# Altium schematic sheet Morpheus_IMU.SchDoc: IMU Motion Detecter
size Letter; CompanyName: Hello Inc.; Organization: Hello Inc.; Revision: DVT; SheetNumber: 3; SheetTotal: 4
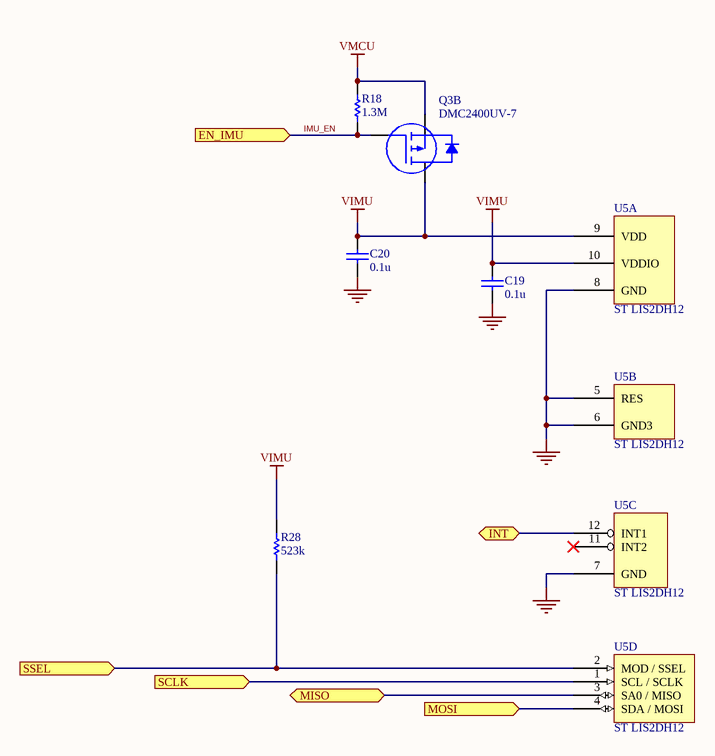
[diagram p0: Morpheus_IMU.SchDoc]

## Parts
C19  0.1u  [CAP0402_SENSE_DVT]
C20  0.1u  [CAP0402_SENSE_DVT]
Q3  DMC2400UV-7  [SOT-563]  (part B of 2)
R18  1.3M  [RES0402_SENSE_DVT]
R28  523k  [RES0402_SENSE_DVT]
U5  ST LIS2DH12  [DFN50P200X200X80-12N]  (parts A,B,C,D of 4)

## Ports
EN_IMU (in), INT (bidir), MISO, MOSI (in), SCLK (in), SSEL (in)

## Nets
GND: C19.1 C20.1 U5.5(RES) U5.6(GND3) U5.7(GND) U5.8(GND)
VIMU: C19.2 C20.2 Q3.3(D2) R28.2 U5.9(VDD) U5.10(VDDIO)
VMCU: Q3.4(S2) R18.2
IMU_EN: Q3.5(G2) R18.1 ; port EN_IMU
INT: U5.12(INT1) ; port INT
MISO: U5.3(SA0_/_MISO) ; port MISO
MOSI: U5.4(SDA_/_MOSI) ; port MOSI
SCLK: U5.1(SCL_/_SCLK) ; port SCLK
SSEL: R28.1 U5.2(MOD_/_SSEL) ; port SSEL

Not connected (* = marked no-connect by the designer): U5 11(INT2)*

## Notes on the sheet
- TITLE
- DATE
- DRAWN BY
- REV
- SHEET
- OF

## Library data of the parts
C19 C20 = C_0.1u_10_50_X7R_0402: Chip capacitor; Vendor: Taiyo Yuden; PN: UMK105B7104KV-FR; Tolerance: 10%; Voltage: 50V; Temp: X7R; Value: 0.1u; Size: 0402
Q3 = DMC2400UV-7: Dual PN-Channel MOSFET 1.2v drive 20V 0.88A; Vendor: Diodes Inc; PN: DMC2400UV-7
R18 = R_1.3M_5_0.1_0402: Chip Resistor; Vendor: Panasonic; Tolerance: 5 %; Power: 0.1 W; PN: ERJ-2GEJ135X; Model: *; Value: 1.3M; Size: 0402
R28 = R_523k_1_0.1_0402: Chip Resistor; Vendor: Panasonic; Tolerance: 1 %; Power: 0.1 W; PN: ERJ-2RKF5233X; Model: *; Value: 523k; Size: 0402
U5 = LIS2DH12: STU Accelerometer; PN: LIS2DH12